# EasyEDA Pro project miniMQ.epro, schematic ArtNet-Pico
Board Name: ArtNet-Pico; Create Date: 2026-08-30; Page Name: P1; Project Name: MagicQ Compact Mini Connect; Schematic Name: ArtNet-Pico; Update Date: 2026-09-11; Company: EasyEDA.com; Page Size: A4; Version: V1.0
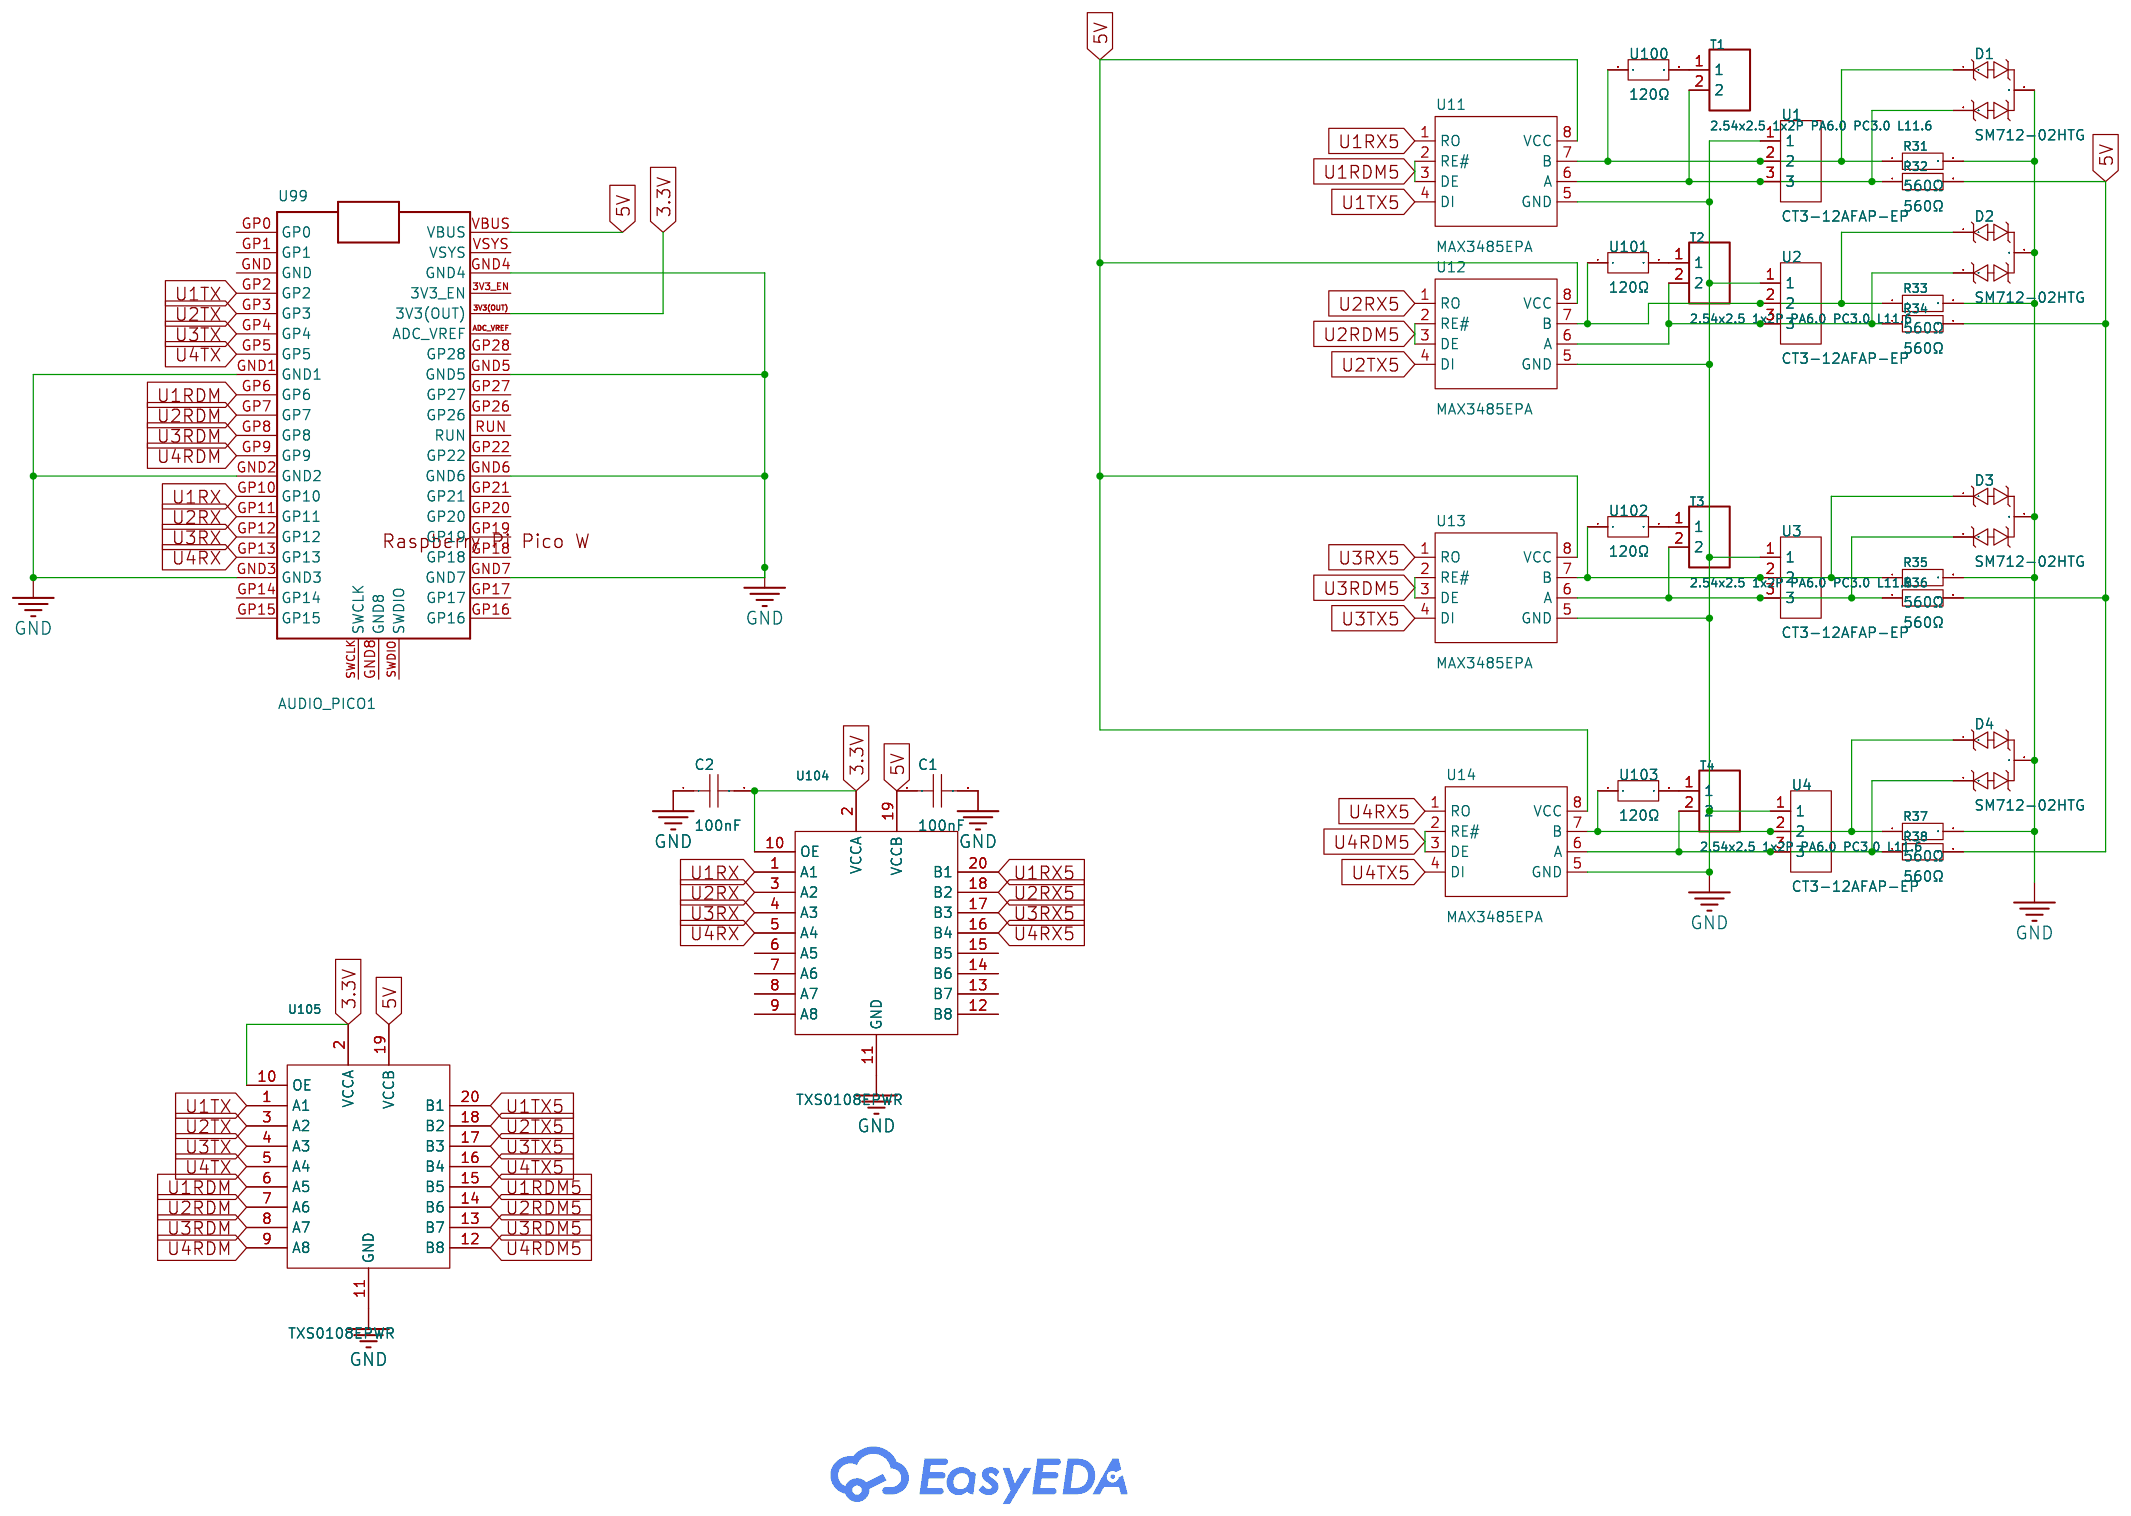
[diagram p4: schematic sheet]

## Parts
C1  100nF  [C0805]
C2  100nF  [C0805]
D1  SM712-02HTG  [SOT-23-3_L2.9-W1.3-P1.90-LS2.4-BR]
D2  SM712-02HTG  [SOT-23-3_L2.9-W1.3-P1.90-LS2.4-BR]
D3  SM712-02HTG  [SOT-23-3_L2.9-W1.3-P1.90-LS2.4-BR]
D4  SM712-02HTG  [SOT-23-3_L2.9-W1.3-P1.90-LS2.4-BR]
R31  560Ω  [R0805]
R32  560Ω  [R0805]
R33  560Ω  [R0805]
R34  560Ω  [R0805]
R35  560Ω  [R0805]
R36  560Ω  [R0805]
R37  560Ω  [R0805]
R38  560Ω  [R0805]
T1  2.54x2.5 1x2P PA6.0 PC3.0 L11.6  [HDR-TH_2P-P2.54-V-M-R2-C1-S2.54_3]
T2  2.54x2.5 1x2P PA6.0 PC3.0 L11.6  [HDR-TH_2P-P2.54-V-M-R2-C1-S2.54_3]
T3  2.54x2.5 1x2P PA6.0 PC3.0 L11.6  [HDR-TH_2P-P2.54-V-M-R2-C1-S2.54_3]
T4  2.54x2.5 1x2P PA6.0 PC3.0 L11.6  [HDR-TH_2P-P2.54-V-M-R2-C1-S2.54_3]
U1  CT3-12AFAP-EP  [CONN-TH_CT3-12AFAP-EP]
U2  CT3-12AFAP-EP  [CONN-TH_CT3-12AFAP-EP]
U3  CT3-12AFAP-EP  [CONN-TH_CT3-12AFAP-EP]
U4  CT3-12AFAP-EP  [CONN-TH_CT3-12AFAP-EP]
U11  MAX3485EPA  [DIP-8_L9.8-W6.6-P2.54-LS7.6-BL]
U12  MAX3485EPA  [DIP-8_L9.8-W6.6-P2.54-LS7.6-BL]
U13  MAX3485EPA  [DIP-8_L9.8-W6.6-P2.54-LS7.6-BL]
U14  MAX3485EPA  [DIP-8_L9.8-W6.6-P2.54-LS7.6-BL]
U99  AUDIO_PICO1  [RASPBERRYPIPICO]
U100  120Ω  [RES-TH_BD2.4-L6.3-P10.30-D0.6]
U101  120Ω  [RES-TH_BD2.4-L6.3-P10.30-D0.6]
U102  120Ω  [RES-TH_BD2.4-L6.3-P10.30-D0.6]
U103  120Ω  [RES-TH_BD2.4-L6.3-P10.30-D0.6]
U104  TXS0108EPWR  [TSSOP-20_L6.5-W4.4-P0.65-LS6.4-BL]
U105  TXS0108EPWR  [TSSOP-20_L6.5-W4.4-P0.65-LS6.4-BL]

## Library data of the parts
C1 C2 = CC0805KRX7R9BB104: Capacitance:100nF Tolerance:±10% Tolerance:±10% Voltage Rating:50V Temperature Coefficient:X7R; LCSC Part Name: 100nF ±10% 50V; Supplier Part: C49678; Manufacturer: YAGEO(国巨); Supplier Footprint: 0805; JLCPCB Part Class: Basic Part; Datasheet: https://item.szlcsc.com/datasheet/CC0805KRX7R9BB104/50686.html; Supplier: LCSC; Tolerance: ±10%; Voltage Rating: 50V; Temperature Coefficient: X7R
D1-D4 = SM712-02HTG: Polarity:Bidirectional Reverse Stand-Off Voltage (Vrwm):7V；12V Clamping Voltage:26V；18V Peak Pulse Current (Ipp):20A@8/20us Peak Pulse Power Dissipation (Ppp):500W@8/20us Voltage - Breakdown:8V；13.3V Reverse Leakage Current (Ir):1uA level of protection:IE; LCSC Part Name: 双向ESD 12V 7V截止 峰值浪涌电流：20A@8/20us; Supplier Part: C3008057; Manufacturer: MSKSEMI(美森科); Supplier Footprint: SOT-23; JLCPCB Part Class: Extended Part; Datasheet: https://item.szlcsc.com/datasheet/SM712-02HTG/3498455.html; Supplier: LCSC; Polarity: Bidirectional; Reverse Stand-Off Voltage (Vrwm): 7V；12V; Clamping Voltage: 26V；18V; Peak Pulse Current (Ipp): 20A@8/20us; Peak Pulse Power Dissipation (Ppp): 500W@8/20us; Voltage - Breakdown: 8V；13.3V; Reverse Leakage Current (Ir): 1uA; level of protection: IEC 61000-4-4；IEC 61000-4-5；IEC 61000-4-2; Type: ESD; Junction Capacitance: 60pF
R31-R38 = 0805W8F5600T5E: Type:Thick Film Resistors Resistance: Tolerance:±1% Tolerance:±1% Power(Watts): Overload Voltage (Max): Temperature Coefficient:±100ppm/℃ Temperature Coefficient:±100ppm/℃ Operating Temperature Range:-55℃~+155℃ Operating Temperature Range:-55℃~+155℃; LCSC Part Name: 560Ω ±1% 125mW 厚膜电阻; Supplier Part: C28636; Manufacturer: UNI-ROYAL(厚声); Supplier Footprint: 0805; JLCPCB Part Class: Basic Part; Datasheet: https://atta.szlcsc.com/upload/public/pdf/source/20200306/C422600_1E6D84923E4A46A82E41ADD87F860B5C.pdf; Supplier: LCSC; Type: Thick Film Resistors; Tolerance: ±1%; Temperature Coefficient: ±100ppm/℃; Operating Temperature Range: -55℃~+155℃
T1-T4 = 2.54x2.5 1x2P PA6.0 PC3.0 L11.6: Pin Structure:1x2P Pitch:2.54mm Circluar Pins/Square Pins:Square pin Mounting Type:Through Hole Number of Rows:1 Number of Pins:2P Current Rating:3A Voltage Rating (Max):500V Contact Material:Brass Contact Plating:Gold Operating Temperature:-40℃~+105℃ Ope; LCSC Part Name: 1x2P 间距:2.54mm 方针 直插; Supplier Part: C55829673; Manufacturer: JMEconn(文章济美); Supplier Footprint: 插件,P=2.54mm; JLCPCB Part Class: Extended Part; Datasheet: https://item.szlcsc.com/datasheet/2.54x2.5%25201x2P%2520PA6.0%2520PC3.0%2520L11.6/59981474.html; Supplier: LCSC; Pin Structure: 1x2P; Pitch: 2.54mm; Circluar Pins/Square Pins: Square pin; Mounting Type: Through Hole; Number of Rows: 1; Number of Pins: 2P; Current Rating: 3A; Voltage Rating (Max): 500V; Contact Material: Brass; Contact Plating: Gold; Operating Temperature: -40℃~+105℃; Color: Black
U1-U4 = CT3-12AFAP-EP: Number of Pins:3P Gender:Female Mounting Type:Right Angle Current Rating:6A Voltage Rating:50V Operating Temperature:-30℃~+80℃ Operating Temperature:-30℃~+80℃; LCSC Part Name: 3Pin 卧式母座 镀金 金属面板 带推柄 螺丝孔接地; Supplier Part: C46594089; Manufacturer: 春生电子; Supplier Footprint: 插件; Datasheet: https://item.szlcsc.com/datasheet/CT3-12AFAP-EP/48729775.html; Supplier: LCSC; Number of Pins: 3P; Gender: Female; Mounting Type: Right Angle; Current Rating: 6A; Voltage Rating: 50V; Operating Temperature: -30℃~+80℃
U11-U14 = MAX3485EPA: Supplier Part: C9900099263; Supplier Footprint: DIP-8P-9.3*6.3-P2.54; JLCPCB Part Class: Extended Part; Supplier: LCSC
U99 = AUDIO_PICO1: Manufacturer Part: RASPBERRY PI PICO; Supplier: Element14; Supplier Part: 3643332; Manufacturer: Raspberry-PI; link: https://se.farnell.com/b/raspberry-pi
U100-U103 = MFR-25FTF52-120R: Type:Metal Film Resistor Resistance:120Ω Tolerance:±1% Tolerance:±1% Power(Watts):250mW Temperature Coefficient:±100ppm/℃ Temperature Coefficient:±100ppm/℃ Operating Temperature:-55℃~+155℃ Operating Temperature:-55℃~+155℃; LCSC Part Name: 金属膜电阻 120Ω ±1% 250mW; Supplier Part: C1371058; Manufacturer: YAGEO(国巨); Supplier Footprint: 插件,D2.4xL6.3mm; JLCPCB Part Class: Extended Part; Datasheet: https://item.szlcsc.com/datasheet/MFR-25FTF52-120R/1461347.html; Supplier: LCSC; Type: Metal Film Resistor; Tolerance: ±1%; Power(Watts): 250mW; Temperature Coefficient: ±100ppm/℃; Operating Temperature: -55℃~+155℃
U104 U105 = TXS0108EPWR: Channel Type:Bidirectional Input Signal:- Output Signal:- Data Rate:60Mbps Voltage - Supply(VCCA):1.4V~3.6V Voltage - Supply(VCCA):1.4V~3.6V Voltage - Supply(VCCB):1.65V~5.5V Voltage - Supply(VCCB):1.65V~5.5V Number of Elements:1 Number of Circuits:8 Outp; LCSC Part Name: 60Mbps 8位双向电平转换器; Supplier Part: C17206; Manufacturer: TI(德州仪器); Supplier Footprint: TSSOP-20; JLCPCB Part Class: Extended Part; Datasheet: https://www.ti.com/cn/lit/ds/symlink/txs0108e.pdf; Supplier: LCSC; Channel Type: Bidirectional; Data Rate: 60Mbps; Voltage - Supply(VCCA): 1.4V~3.6V; Voltage - Supply(VCCB): 1.65V~5.5V; Number of Elements: 1; Number of Circuits: 8; Output Type: Open-drain；Push-Pull; Operating Temperature: -40℃~+85℃; Features: Automatic direction detection；Output enable high-impedance；Integrated pull-up resistor; Translator Type: Level translator

## Nets
3.3V: C2.2 U99.3V3(OUT) U104.2(VCCA) U104.10(OE) U105.2(VCCA) U105.10(OE)
5V: C1.1 R32.2 R34.2 R36.2 R38.2 U11.8(VCC) U12.8(VCC) U13.8(VCC) U14.8(VCC) U99.VBUS U104.19(VCCB) U105.19(VCCB)
GND: C1.2 C2.1 D1.3 D2.3 D3.3 D4.3 R31.2 R33.2 R35.2 R37.2 U1.1 U2.1 U3.1 U4.1 U11.5(GND) U12.5(GND) U13.5(GND) U14.5(GND) U99.GND1 U99.GND2 U99.GND3 U99.GND4 U99.GND5 U99.GND6 U99.GND7 U104.11(GND) U105.11(GND)
U1RDM: U99.GP6 U105.6(A5)
U1RDM5: U11.2(RE#) U11.3(DE) U105.15(B5)
U1RX: U99.GP10 U104.1(A1)
U1RX5: U11.1(RO) U104.20(B1)
U1TX: U99.GP2 U105.1(A1)
U1TX5: U11.4(DI) U105.20(B1)
U2RDM: U99.GP7 U105.7(A6)
U2RDM5: U12.2(RE#) U12.3(DE) U105.14(B6)
U2RX: U99.GP11 U104.3(A2)
U2RX5: U12.1(RO) U104.18(B2)
U2TX: U99.GP3 U105.3(A2)
U2TX5: U12.4(DI) U105.18(B2)
U3RDM: U99.GP8 U105.8(A7)
U3RDM5: U13.2(RE#) U13.3(DE) U105.13(B7)
U3RX: U99.GP12 U104.4(A3)
U3RX5: U13.1(RO) U104.17(B3)
U3TX: U99.GP4 U105.4(A3)
U3TX5: U13.4(DI) U105.17(B3)
U4RDM: U99.GP9 U105.9(A8)
U4RDM5: U14.2(RE#) U14.3(DE) U105.12(B8)
U4RX: U99.GP13 U104.5(A4)
U4RX5: U14.1(RO) U104.16(B4)
U4TX: U99.GP5 U105.5(A4)
U4TX5: U14.4(DI) U105.16(B4)
$1N562: D2.1 R33.1 U2.2 U12.7(B) U101.1
$1N566: D2.2 R34.1 T2.2 U2.3 U12.6(A)
$1N570: D1.1 R31.1 U1.2 U11.7(B) U100.1
$1N572: D1.2 R32.1 T1.2 U1.3 U11.6(A)
$1N1506: D4.1 R37.1 U4.2 U14.7(B) U103.1
$1N1508: D4.2 R38.1 T4.2 U4.3 U14.6(A)
$1N3125: D3.2 R36.1 T3.2 U3.3 U13.6(A)
$1N3129: D3.1 R35.1 U3.2 U13.7(B) U102.1
$1N9213: T1.1 U100.2
$1N9270: T2.1 U101.2
$1N9328: T3.1 U102.2
$1N9385: T4.1 U103.2

Not connected (* = marked no-connect by the designer): U99 3V3_EN ADC_VREF GND GND8 GP0 GP1 GP14 GP15 GP16 GP17 GP18 GP19 GP20 GP21 GP22 GP26 GP27 GP28 RUN SWCLK SWDIO VSYS; U104 6(A5) 7(A6) 8(A7) 9(A8) 12(B8) 13(B7) 14(B6) 15(B5)
